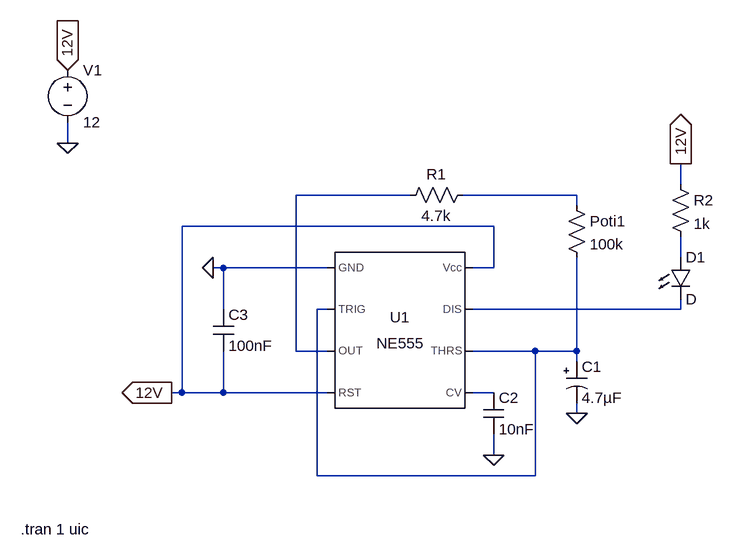
[diagram p0: schematic LED_blink.asc]
LED_blink.asc, the LTspice schematic file:
Version 4
SHEET 1 904 680
WIRE -336 -112 -336 -144
WIRE 608 -48 608 -80
WIRE 192 -32 16 -32
WIRE 448 -32 272 -32
WIRE 448 -16 448 -32
WIRE 320 16 -160 16
WIRE 608 64 608 32
WIRE -96 80 -112 80
WIRE 64 80 -96 80
WIRE 320 80 320 16
WIRE 320 80 288 80
WIRE -96 144 -96 80
WIRE 64 144 48 144
WIRE 608 144 608 128
WIRE 608 144 288 144
WIRE 16 208 16 -32
WIRE 64 208 16 208
WIRE 384 208 288 208
WIRE 448 208 448 64
WIRE 448 208 384 208
WIRE 448 224 448 208
WIRE -160 272 -160 16
WIRE -160 272 -176 272
WIRE -96 272 -96 208
WIRE -96 272 -160 272
WIRE 64 272 -96 272
WIRE 320 272 288 272
WIRE 448 304 448 288
WIRE 320 368 320 336
WIRE 48 400 48 144
WIRE 384 400 384 208
WIRE 384 400 48 400
FLAG -336 -112 0
FLAG -336 -224 12V
IOPIN -336 -224 In
FLAG -176 272 12V
IOPIN -176 272 Out
FLAG 320 368 0
FLAG 448 304 0
FLAG -112 80 0
FLAG 608 -80 12V
IOPIN 608 -80 Out
SYMBOL Misc\\NE555 176 176 R0
SYMATTR InstName U1
SYMBOL LED 592 64 R0
SYMATTR InstName D1
SYMBOL cap 304 272 R0
SYMATTR InstName C2
SYMATTR Value 10nF
SYMBOL voltage -336 -240 R0
WINDOW 123 0 0 Left 2
WINDOW 39 0 0 Left 2
SYMATTR InstName V1
SYMATTR Value 12
SYMBOL polcap 432 224 R0
SYMATTR InstName C1
SYMATTR Value 4.7µF
SYMBOL cap -112 144 R0
SYMATTR InstName C3
SYMATTR Value 100nF
SYMBOL res 288 -48 R90
WINDOW 0 0 56 VBottom 2
WINDOW 3 32 56 VTop 2
SYMATTR InstName R1
SYMATTR Value 4.7k
SYMBOL res 432 -32 R0
SYMATTR InstName Poti1
SYMATTR Value 100k
SYMBOL res 592 -64 R0
SYMATTR InstName R2
SYMATTR Value 1k
TEXT -408 482 Left 2 !.tran 1 uic

The netlist it stands for:
* LED_blink.asc
XU1 0 N004 N001 12V N006 N004 N005 12V NE555  ; pins GND TRIG OUT RST CV THRS DIS Vcc
D1 N003 N005 D
C2 N006 0 10nF
V1 12V 0 12
C1 N004 0 4.7µF
C3 0 12V 100nF
R1 N002 N001 4.7k
R§Poti1 N002 N004 100k
R2 12V N003 1k
.model D D
.lib standard.dio
.tran 1 uic
.lib NE555.sub
.backanno
.end